# EAGLE design EnvironmentMonitorV4 (EAGLE 7.4.0)
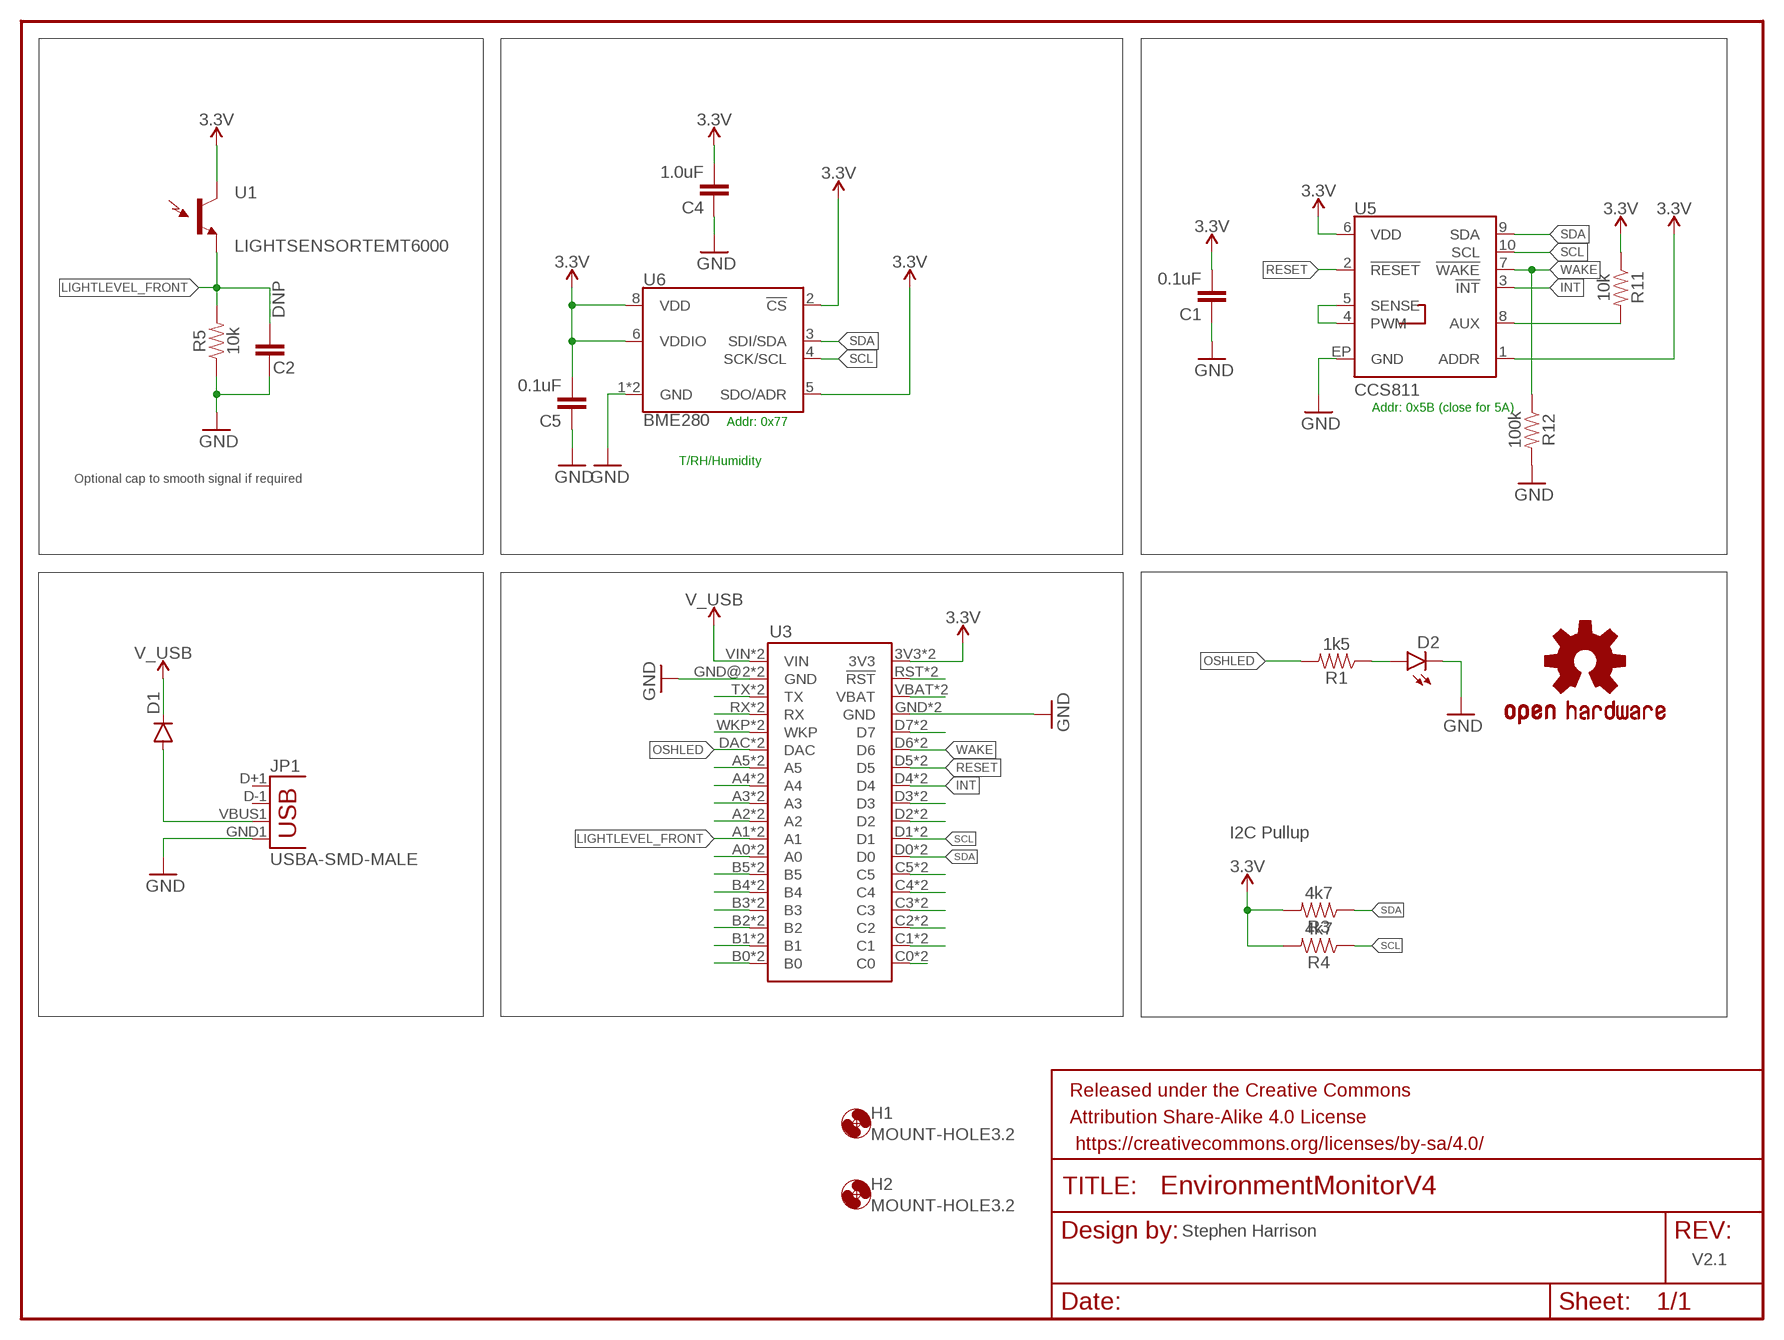
[diagram p0: schematic, sheet 1]

## Parts
C1  0.1uF  1.0UF-25V-+80/-20(0805)"  [0805-CAP]
C2  DNP  1.0UF-25V-+80/-20(0805)"  [0805-CAP]
C4  1.0uF  1.0UF-25V-+80/-20(0805)"  [0805-CAP]
C5  0.1uF  1.0UF-25V-+80/-20(0805)"  [0805-CAP]
D1  DIODESMA  [SMA-DIODE]
D2  LED1206-BOTTOM  [LED-1206-BOTTOM]
FRAME1  FRAME-LETTER  [CREATIVE_COMMONS]
H1  MOUNT-HOLE3.2  [3,2]
H2  MOUNT-HOLE3.2  [3,2]
JP1  USBA-SMD-MALE  [USB-A-SMT-MALE]
LOGO1  OSHW-LOGOM  [OSHW-LOGO-M]
R1  1k5  RESISTOR0805  [0805]
R3  4k7  RESISTOR0805  [0805]
R4  4k7  RESISTOR0805  [0805]
R5  10k  RESISTOR0805  [0805]
R11  10k  RESISTOR0805  [0805]
R12  100k  RESISTOR0805  [0805]
U1  LIGHTSENSORTEMT6000  [TEMT6000-SEN]
U3  ELECTRONDUALNAMED  [ELECTRON_SIMPLE_SILK_NAMES_DUAL]
U5  CCS811  [LGA10]
U6  BME280  [LGA-8-2.5X2.5]

## Nets
3.3V: C1.2 C4.2 C5.2 R3.2 R4.2 R11.1 U1.COLLECTOR(C1) U3.3V3 U3.3V3_1(3V3) U5.1(ADDR) U5.6(VDD) U6.2(!CS) U6.5(SDO/ADR) U6.6(VDDIO) U6.8(VDD)
AUX: R11.2 U5.8(AUX)
GND: C1.1 C2.1 C4.1 C5.1 D2.C JP1.GND1(GND) R5.1 R12.2 U3.GND U3.GND@2(GND) U3.GND_1(GND) U3.GND_1B(GND) U5.EP(GND) U6.1(GND) U6.7(GND)
INT: U3.D4 U3.D4_1(D4) U5.3(!INT!)
LIGHTLEVEL_FRONT: C2.2 R5.2 U1.EMITTER(E1) U3.A1 U3.A1_1(A1)
LIGHTLEVEL_REAR: U3.A0 U3.A0_1(A0)
N$1: U3.RST(!RST) U3.RST_1(!RST)
N$2: U3.VBAT U3.VBATT_1(VBAT)
N$4: U3.WKP U3.WKP_1(WKP)
N$5: D1.A JP1.VBUS1(VBUS)
N$6: D2.A R1.1
N$7: U3.D7 U3.D7_1(D7)
N$8: U3.D2 U3.D2_1(D2)
N$10: U3.D3 U3.D3_1(D3)
N$11: U3.C5 U3.C5_1(C5)
N$12: U3.C4 U3.C4_1(C4)
N$13: U3.C3 U3.C3_1(C3)
N$14: U3.C2 U3.C2_1(C2)
N$15: U3.C1 U3.C1_1(C1)
N$16: U3.C0 U3.C0_1(C0)
N$17: U3.B0 U3.B0_1(B0)
N$18: U3.B1 U3.B1_1(B1)
N$19: U3.B2 U3.B2_1(B2)
N$20: U3.B3 U3.B3_1(B3)
N$21: U3.B4 U3.B4_1(B4)
N$22: U3.B5 U3.B5_1(B5)
N$25: U3.A2 U3.A2_1(A2)
N$26: U3.A3 U3.A3_1(A3)
N$27: U3.A4 U3.A4_1(A4)
N$28: U3.A5 U3.A5_1(A5)
N$31: U3.RX U3.RX_1(RX)
N$32: U3.TX U3.TX_1(TX)
NTC_SENSE: U5.4(PWM) U5.5(SENSE)
OSHLED: R1.2 U3.DAC U3.DAC_1(DAC)
RESET: U3.D5 U3.D5_1(D5) U5.2(!RESET!)
SCL: R4.1 U3.D1 U3.D1_1(D1) U5.10(SCL) U6.4(SCK/SCL)
SDA: R3.1 U3.D0 U3.D0_1(D0) U5.9(SDA) U6.3(SDI/SDA)
V_USB: D1.C U3.VIN U3.VIN_1B(VIN)
WAKE: R12.1 U3.D6 U3.D6_1(D6) U5.7(!WAKE!)
Unconnected: JP1.D+1(D+) JP1.D-1(D-)

## Notes on the sheet
- Addr: 0x5B (close for 5A)
- Addr: 0x77
- T/RH/Humidity
- Optional cap to smooth signal if required
- I2C Pullup
- Stephen Harrison
- V2.1

## Library data of the parts
C1 C2 C5 = SparkFun-Capacitors:1.0UF-25V-+80/-20(0805): CAP-11625; PROD_ID: CAP-11625; VALUE: 1.0uF
C4 = SparkFun-Capacitors:1.0UF-25V-+80/-20(0805): CAP-11625; PROD_ID: CAP-11625
D1 = SparkFun-DiscreteSemi:DIODE: Diode These are standard reverse protection diodes and small signal diodes. SMA package can handle up to about 1A. SOD-323 can handle about 200mA. What the SOD-323 package when ordering, there are some mfgs out there that are 5-pin packages.
D2 = SparkFun-LED:LED: LEDs Standard schematic elements and footprints for 5mm, 3mm, 1206, and 0603 sized LEDs. 5mm - Spark Fun Electronics SKU : COM-00529 (and others)
FRAME1 = SparkFun-Aesthetics:FRAME-LETTER: Schematic Frame - Letter Standard 8.5x11 US Letter frame
H1 H2 = holes:MOUNT-HOLE: MOUNTING HOLE with drill center marker
JP1 = Tinamous:USB: USB Connectors USB-B-PTH is fully proven SKU : PRT-00139/CONN-08278 USB-miniB is fully proven SKU : PRT-00587 USB-A-PCB is untested. USB-A-H is throughly reviewed, but untested. Spark Fun Electronics SKU : PRT-00437 USB-B-SMT is throughly reviewed, but untested. Needs silkscreen touching up. USB-A-S has not been used/tested USB-MB-H has not been used/tested USB-MICROB has been used. CONN-09505
LOGO1 = SparkFun-Aesthetics:OSHW-LOGO: Open-Source Hardware (OSHW) Logo This logo indicates the piece of hardware it is found on incorporates a OSHW license and/or adheres to the definition of open source hardware found here: http://freedomdefined.org/OSHW
R1 R3-R5 R11 R12 = SparkFun-Resistors:RESISTOR: Generic Resistor Package
U1 = SparkFun-Sensors:LIGHTSENSOR: Ambient Light Sensor Simple light detection sensor. Output varies with light intensity input. Spark Fun Electronics SKU : COM-08348
U3 = Tinamous:ELECTRON
U5 = CCS811_Breakout_Temp:CCS811: AMS CCS811 – I2C Digital Gas Sensor Ultra-Low Power Digital Gas Sensor for Monitoring Indoor Air Quality AMS Product Page <http://ams.com/eng/Products/Environmental-Sensors/Gas-Sensors/CCS811> SparkFun Products:; PROD_ID: IC-13607
U6 = SparkFun-Sensors:BME280: Bosch BME280 – Combined Humidity and Pressure Sensor The BME280 is as combined digital humidity, pressure and temperature sensor based on proven sensing principles. The sensor module is housed in an extremely compact metal-lid LGA package with a footprint of only 2.5×2.5mm² with a height of 0.93mm. Its small dimensions and its low power consumption allow the implementation in battery driven devices such as handsets, GPS modules or watches. Datasheet <https://cdn.sparkfun.com/assets/learn_tutorials/4/1/9/BST-BME280_DS001-10.pdf> SparkFun Products SparkFun Atmospheric Sensor Breakout - BME280 <https://www.sparkfun.com/products/13676> (SEN-13676); PROD_ID: IC-13090

## Board
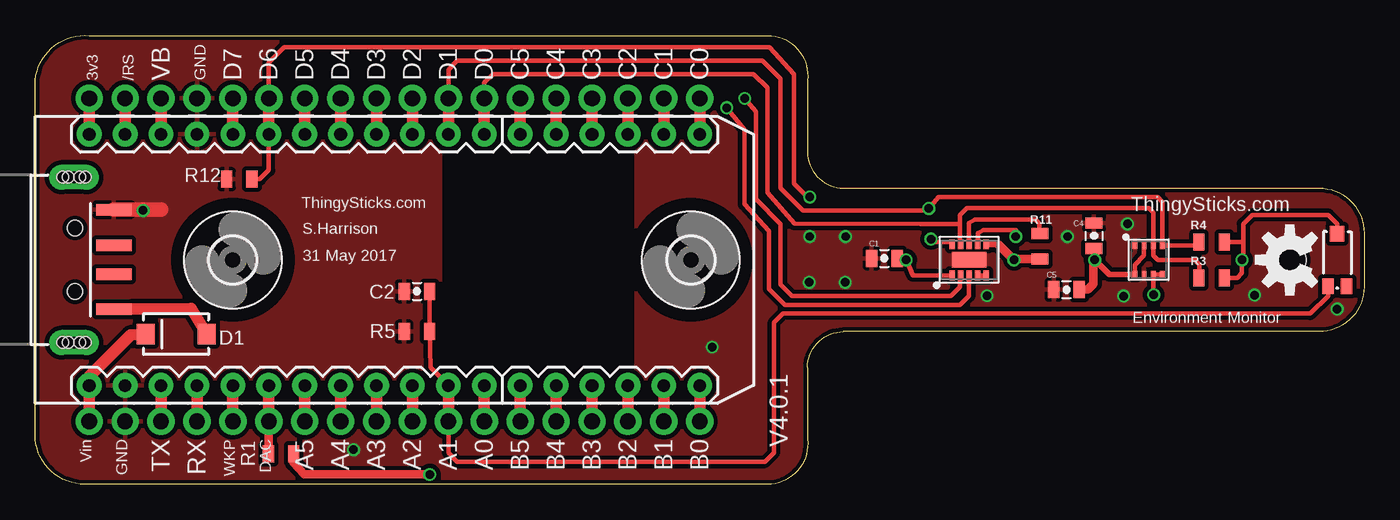
[diagram p1: board, top side]
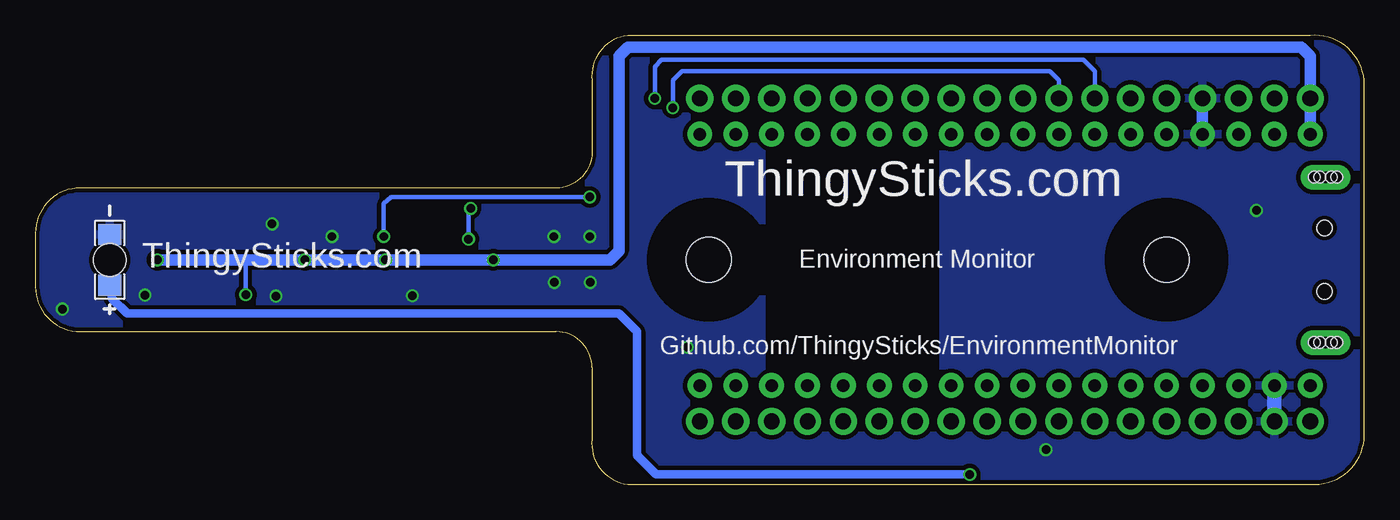
[diagram p2: board, bottom side, seen from below]

Size 93.98 x 31.78 mm. Coordinates in mm from the lower left corner, seen from the top.
Outline: 0,3.19 0,28.59 arc-90 3.81,31.76 52.07,31.76 arc-90 54.61,28.59 54.61,23.51 arc90 57.15,20.97 90.81,20.97 arc-90 93.98,17.79 93.98,13.98 arc-90 90.81,10.81 57.15,10.81 arc90 54.61,8.27 54.61,3.19 arc-90 52.07,0.01 3.81,0.01 arc-90 0,3.19
Copper layers (1*16): Top 0.035mm / dielectric 1.5mm / Bottom 0.035mm
Design rules "dirt_cheap_dirty_boards.v1": minimum track width 5mil, minimum drill 12mil, track to track 5mil, track to pad 5mil, pad to pad 5mil, via to via 5mil, smd to smd 0mil, copper to edge 10mil, drill to drill 10mil, minimum pad ring 10mil, minimum via ring 6mil, stop-mask expansion 2mil, vias tented up to drill 25mil, thermal gap 10mil
tRestrict: area 29.2,5.1 to 41.9,26.7
bRestrict: area 30.5,5.1 to 41.9,26.7

### Footprints (pad centres in the part's own frame; a part is rotated, then mirrored left to right if it is on the bottom)
0805-CAP = smd 0.8 x 1.2: 1 -0.9,0; 2 0.9,0
SMA-DIODE = smd 1.27 x 1.47: A -2.15,0; C 2.15,0
LED-1206-BOTTOM = smd 1.5 x 1.6: A -1.8,0; C 1.8,0 | hole 2.3: 0,0
3,2 = hole 3.2: 0,0
USB-A-SMT-MALE = smd 0.8 x 2.5: D+1 1.027,-5.87; D-1 -1.027,-5.87; GND1 3.551,-5.87; VBUS1 -3.5,-5.87 | drill 0.8 pad 1.778 long: P$1 5.85,-3.05; P$3 -5.85,-3.05 | hole 1.1: 2.25,-3.12; -2.25,-3.12 | hole 0.8: -5.85,-3.45; -5.85,-3.85; -5.85,-2.65; -5.85,-2.25; 5.85,-3.45; 5.85,-3.85; 5.85,-2.65; 5.85,-2.25
0805 = smd 0.8 x 1.2: 1 -0.9,0; 2 0.9,0
TEMT6000-SEN = smd 1.1 x 0.8: BASE -1.87,-0.65; EMITTER -1.87,0.65 | smd 1.1 x 1: COLLECTOR 1.86,0.01
ELECTRON_SIMPLE_SILK_NAMES_DUAL = drill 0.889 pad 1.753: 3V3 1.27,22.86; A0 29.21,5.08; A1 26.67,5.08; A2 24.13,5.08; A3 21.59,5.08; A4 19.05,5.08; A5 16.51,5.08; B0 44.45,5.08; B1 41.91,5.08; B2 39.37,5.08; B3 36.83,5.08; B4 34.29,5.08; B5 31.75,5.08; C0 44.45,22.86; C1 41.91,22.86; C2 39.37,22.86; C3 36.83,22.86; C4 34.29,22.86; C5 31.75,22.86; D0 29.21,22.86; D1 26.67,22.86; D2 24.13,22.86; D3 21.59,22.86; D4 19.05,22.86; D5 16.51,22.86; D6 13.97,22.86; D7 11.43,22.86; DAC 13.97,5.08; GND 8.89,22.86; GND@2 3.81,5.08; RST 3.81,22.86; RX 8.89,5.08; TX 6.35,5.08; VBAT 6.35,22.86; VIN 1.27,5.08; WKP 11.43,5.08 | drill 1.1 pad 1.93: 3V3_1 1.27,25.4; A0_1 29.21,2.54; A1_1 26.67,2.54; A2_1 24.13,2.54; A3_1 21.59,2.54; A4_1 19.05,2.54; A5_1 16.51,2.54; B0_1 44.45,2.54; B1_1 41.91,2.54; B2_1 39.37,2.54; B3_1 36.83,2.54; B4_1 34.29,2.54; B5_1 31.75,2.54; C0_1 44.45,25.4; C1_1 41.91,25.4; C2_1 39.37,25.4; C3_1 36.83,25.4; C4_1 34.29,25.4; C5_1 31.75,25.4; D0_1 29.21,25.4; D1_1 26.67,25.4; D2_1 24.13,25.4; D3_1 21.59,25.4; D4_1 19.05,25.4; D5_1 16.51,25.4; D6_1 13.97,25.4; D7_1 11.43,25.4; DAC_1 13.97,2.54; GND_1 8.89,25.4; GND_1B 3.81,2.54; RST_1 3.81,25.4; RX_1 8.89,2.54; TX_1 6.35,2.54; VBATT_1 6.35,25.4; VIN_1B 1.27,2.54; WKP_1 11.43,2.54
LGA10 = smd 0.7 x 0.4: 1 -1.1,1.2; 2 -1.1,0.6; 3 -1.1,0; 4 -1.1,-0.6; 5 -1.1,-1.2; 6 1.1,-1.2; 7 1.1,-0.6; 8 1.1,0; 9 1.1,0.6; 10 1.1,1.2 | smd 1.1 x 2.45: EP 0,0
LGA-8-2.5X2.5 = smd 0.35 x 0.5: 1 -0.975,1.025; 2 -0.325,1.025; 3 0.325,1.025; 4 0.975,1.025; 5 0.975,-1.025; 6 0.325,-1.025; 7 -0.325,-1.025; 8 -0.975,-1.025

### Placement (x,y rotation side)
C1  60.05,15.99 0 top
C2  26.99,13.67 0 top
C4  74.88,17.59 270 top
C5  72.92,13.78 0 top
D1  9.96,10.63 180 top
D2  88.72,15.89 90 bottom
FRAME1  1.27,-17.13 0 top  (outside the outline)
H1  13.97,15.89 0 top
H2  46.35,15.89 0 top
JP1  -0.32,15.89 90 top
LOGO1  88.72,15.89 90 top
R1  17.37,2.15 180 top
R3  83.19,14.62 0 top
R4  83.19,17.16 0 top
R5  26.99,10.81 0 top
R11  71.03,16.85 90 top
R12  14.43,21.6 180 top
U1  92.08,15.89 90 top
U3  2.54,1.92 0 top
U5  66.04,15.89 90 top
U6  78.74,15.89 0 top

### Tracks (layer width: path | path; a pad name or v marks a point on that pad's centre or on a via)
3.3V  (via drill 0.6)
  Top 0.305: U6.8 77.75,14.88 77.75,15.53 78.42,16.2 U6.2 | U1.COLLECTOR 92.06,18.44 91.44,19.06 86.06,19.06 85.42,18.43 85.42,17.16 | U6.5 U6.6 79.06,13.61 v79.1,13.43 | 85.42,17.16 85.42,15.97 v85.34,15.89 85.34,14.95 85.01,14.62 R3.2 | R4.2 85.42,17.16 | U5.1 62.06,14.79 v61.59,15.89
  Top 0.406: U6.8 75.95,14.86 v74.93,15.89 | U5.6 68.11,16.99 | 69.25,15.85 v69.22,15.89
  Top 0.61: 68.11,16.99 v69.22,15.89 69.28,15.95 R11.1 | C4.2 74.98,16.3 v74.93,15.89 74.83,15.79 74.83,14.19 74.42,13.78 C5.2 | 61.59,15.91 v61.59,15.89 61.49,15.99 C1.2
  Top 0.813: U3.3V3 U3.3V3_1
  Bottom 0.305: v79.1,13.43 79.1,15.53 78.74,15.89
  Bottom 0.813: U3.3V3 3.81,30.32 4.45,30.95 52.07,30.95 52.7,30.32 52.7,16.52 53.34,15.89 v61.59,15.89 v69.22,15.89 v74.93,15.89 78.74,15.89 v85.34,15.89
AUX
  Top 0.305: U5.8 66.04,18.51 66.45,18.76 70.71,18.76 71.02,18.45 71.02,17.77 R11.2
GND  (via drill 0.6)
  Top 0.305: 78.42,14.86 U6.7
  Top 1.016: JP1.GND1 8.89,19.44
  Bottom 0.813: U3.GND_1 U3.GND
  Bottom 1.016: U3.GND@2 U3.GND_1B
  other vias: 7.62,19.38 54.76,17.54 47.88,9.72 76.96,13.32 77.24,18.43 54.74,14.29 22.5,2.45 67.31,13.35 57.3,17.54 57.28,14.29 73,17.54 86.23,13.4 92.08,12.41
  pour Bottom (isolate 0.305): 93.98,32.4 93.98,-0.62 -0.64,-0.62 -0.64,32.4
  pour Top (isolate 0.305): -0.64,32.4 93.98,32.4 93.98,-0.62 -0.64,-0.62
INT  (via drill 0.6)
  Top 0.305: U5.3 66.04,13.35 65.41,12.71 53.01,12.71 51.89,13.83 51.89,17.92 50.14,19.83 50.14,25.11 v48.9,26.66
  Top 0.813: U3.D4 U3.D4_1
  Bottom 0.305: v48.9,26.66 48.9,28.59 48.26,29.22 22.23,29.22 21.59,28.59 U3.D4_1
LIGHTLEVEL_FRONT
  Top 0.305: U3.A1_1 29.21,2.25 29.84,1.61 51.59,1.61 52.22,2.25 52.25,11.44 52.88,12.08 90.17,12.08 91.42,13.33 U1.EMITTER | U3.A1 27.94,8.27 R5.2 C2.2
  Top 0.813: U3.A1_1 U3.A1
LIGHTLEVEL_REAR
  Top 0.813: U3.A0 U3.A0_1
  Bottom 0.305: U3.A0 31.75,7.63
N$1
  Top 0.813: U3.RST U3.RST_1
N$2
  Top 0.813: U3.VBATT_1 U3.VBAT
N$4
  Top 0.813: U3.WKP_1 U3.WKP
N$5
  Top 0.813: D1.A 11.02,12.44 8.41,12.41 6.79,12.41 JP1.VBUS1
N$6  (via drill 0.6)
  Top 0.61: R1.1 18.26,1.51 19,0.7 v27.89,0.7
  Bottom 0.61: D2.A 88.69,13.88 88.57,13.91 88.57,13.17 87.48,12.08 52.7,12.08 51.44,10.81 51.44,2.05 50.09,0.7 v27.89,0.7
N$7
  Top 0.813: U3.D7 U3.D7_1
N$8
  Top 0.813: U3.D2_1 U3.D2
N$10
  Top 0.813: U3.D3 U3.D3_1
N$11
  Top 0.813: U3.C5 U3.C5_1
N$12
  Top 0.813: U3.C4_1 U3.C4
N$13
  Top 0.813: U3.C3 U3.C3_1
N$14
  Top 0.813: U3.C2_1 U3.C2
N$15
  Top 0.813: U3.C1 U3.C1_1
N$16
  Top 0.813: U3.C0_1 U3.C0
N$17
  Top 0.813: U3.B0 U3.B0_1
N$18
  Top 0.813: U3.B1_1 U3.B1
N$19
  Top 0.813: U3.B2 U3.B2_1
N$20
  Top 0.813: U3.B3_1 U3.B3
N$21
  Top 0.813: U3.B4 U3.B4_1
N$22
  Top 0.813: U3.B5_1 U3.B5
N$25
  Top 0.813: U3.A2 U3.A2_1
N$26
  Top 0.813: U3.A3_1 U3.A3
N$27
  Top 0.813: U3.A4 U3.A4_1
N$28
  Top 0.813: U3.A5 U3.A5_1
N$31
  Top 0.813: U3.RX U3.RX_1
N$32
  Top 0.813: U3.TX U3.TX_1
NTC_SENSE
  Top 0.305: U5.5 U5.4 67.23,14.65
OSHLED
  Top 0.61: R1.2 16.55,2.21 16.51,2.86 U3.DAC_1
  Top 0.813: U3.DAC U3.DAC_1
RESET  (via drill 0.6)
  Top 0.305: U5.2 65.41,14.75 65.41,13.98 64.77,13.35 53.52,13.35 52.7,14.16 52.7,18.43 50.95,20.18 50.95,26.38 v50.16,27.32
  Top 0.813: U3.D5_1 U3.D5
  Bottom 0.305: v50.16,27.32 50.16,29.55 49.68,30.04 19.86,30.04 19.05,29.22 U3.D5_1
SCL  (via drill 0.6)
  Top 0.305: U3.D1_1 29.21,29.35 29.84,29.99 51.44,29.99 52.7,28.72 52.7,20.97 54.28,19.39 62.84,19.39 63.02,19.52 v63.2,19.52 63.86,20.33 79.38,20.33 79.72,19.99 U6.4 82.04,16.91 R4.1 | U5.10 64.84,17.14 63.57,17.14 v63.35,17.36
  Top 0.813: U3.D1 U3.D1_1
  Bottom 0.305: v63.35,17.36 63.35,19.52 v63.2,19.52
SDA
  Top 0.305: U3.D0_1 31.75,28.41 32.38,29.05 50.8,29.05 51.77,28.08 51.77,20.66 53.68,18.44 62.59,18.43 65.41,18.43 | 65.41,18.43 65.38,18.45 65.38,17.05 U5.9 | 65.41,18.43 65.41,19.06 65.89,19.55 78.74,19.55 79.06,19.23 U6.3 79.06,16.2 79.38,15.89 81.99,15.89 82.32,15.56 82.32,14.66 R3.1
  Top 0.813: U3.D0_1 U3.D0
V_USB
  Top 0.813: D1.C 6.74,10.56 3.81,7.63 U3.VIN U3.VIN_1B
WAKE  (via drill 0.6)
  Top 0.305: v54.76,20.33 54.62,20.33 53.66,21.3 53.66,29.05 51.92,30.94 28.78,30.95 17.6,30.95 16.51,29.86 U3.D6_1 16.6,27.41 | U5.7 66.67,17.02 66.67,17.79 66.7,17.79 67.06,18 69.34,18 v69.34,17.54 | R12.1 15.88,21.6 16.51,22.24 U3.D6
  Top 0.813: U3.D6_1 U3.D6
  Bottom 0.305: v69.34,17.54 69.34,19.88 68.81,20.33 v54.76,20.33

### Text on the board
tNames: ThingySticks.com | ThingySticks.com | S.Harrison | 31 May 2017 | Environment Monitor | V4.0.1
bNames: ThingySticks.com | Environment Monitor | ThingySticks.com | Github.com/ThingySticks/EnvironmentMonitor